# EAGLE design 22VPowerBoard (EAGLE 8.5.0)
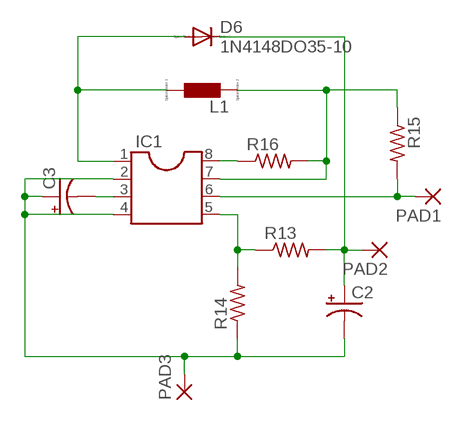
[diagram p0: schematic, sheet 1]

## Parts
C2  CPOL-USE2.5-7  [E2,5-7]
C3  CPOL-USE2.5-7  [E2,5-7]
D6  1N4148DO35-10  [DO35-10]
IC1  DIL8  [DIL08]
L1  L0207/10  [0207/10]
PAD1  3,81/1,4  [3,81/1,4]
PAD2  3,81/1,4  [3,81/1,4]
PAD3  3,81/1,4  [3,81/1,4]
R13  R-US_0207/7  [0207/7]
R14  R-US_0207/7  [0207/7]
R15  R-US_0207/7  [0207/7]
R16  R-US_0207/7  [0207/7]

## Nets
N$1: C2.- C3.+ IC1.2 IC1.4 PAD3.1(P) R14.1
N$5: D6.A IC1.1 L1.1
N$10: C3.- IC1.3
N$11: IC1.8 R16.1
N$12: IC1.7 L1.2 R15.1 R16.2
N$13: IC1.5 R13.1 R14.2
VDD: IC1.6 PAD1.1(P) R15.2
VG2: C2.+ D6.C PAD2.1(P) R13.2

## Library data of the parts
C2 C3 = rcl:CPOL-US: POLARIZED CAPACITOR, American symbol; SPICEPREFIX: C
D6 = diode:1N4148: DIODE high speed (Philips)
IC1 = ic-package:DIL8: Dual In Line / Socket
L1 = eagle-ltspice:L: INDUCTOR, European symbol; SPICEMODEL: NONE; SPICEPREFIX: L
PAD1-PAD3 = wirepad:3,81/1,4: THROUGH-HOLE PAD
R13-R16 = rcl:R-US_: RESISTOR, American symbol; SPICEPREFIX: R

## Board
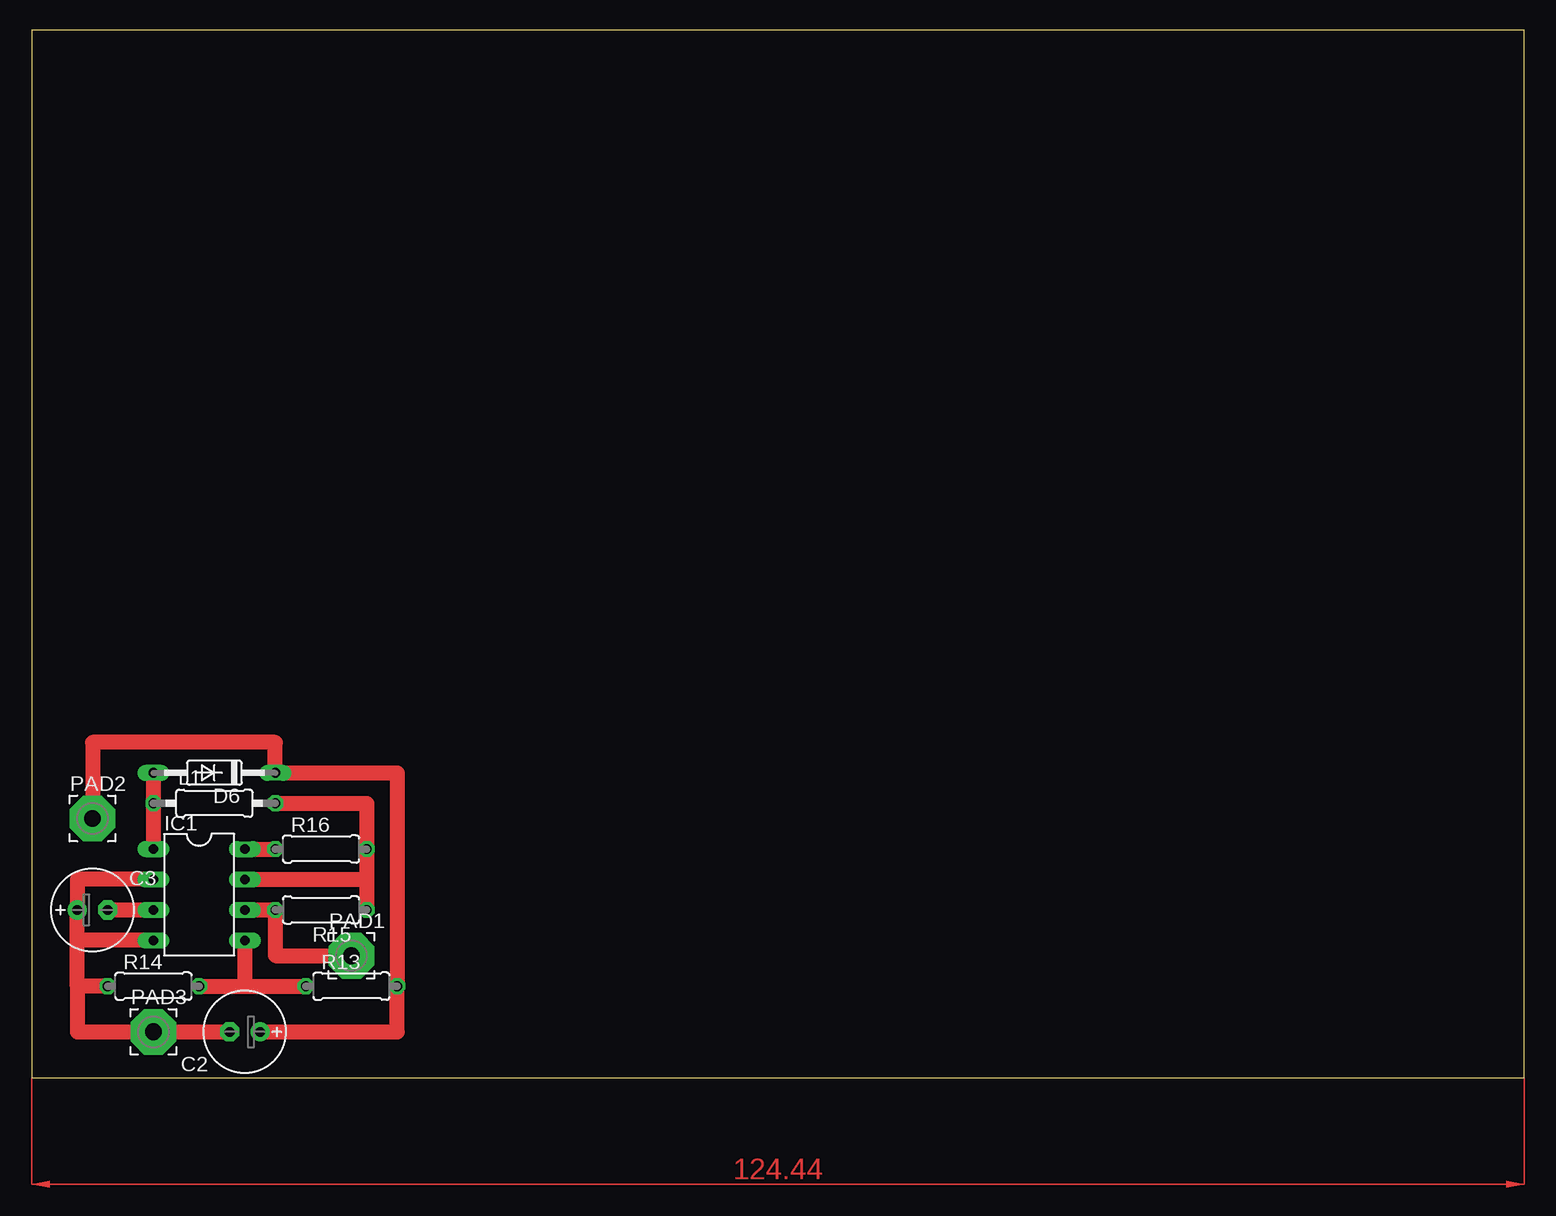
[diagram p1: board, top side]

Size 124.44 x 87.3 mm. Coordinates in mm from the lower left corner, seen from the top.
Outline: 0,0 124.44,0 124.44,87.3 0,87.3 0,0
Copper layers (1*16): Top 0.035mm / dielectric 1.5mm / Bottom 0.035mm
Design rules "default": minimum track width 6mil, minimum drill 0.35mm, track to track 6mil, track to pad 6mil, pad to pad 6mil, via to via 6mil, smd to smd 6mil, copper to edge 40mil, drill to drill 6mil, minimum pad ring 10mil, minimum via ring 8mil, stop-mask expansion 4mil, vias tented up to drill 0mil, thermal gap 10mil

### Footprints (pad centres in the part's own frame; a part is rotated, then mirrored left to right if it is on the bottom)
E2,5-7 = drill 0.813 pad 1.6: + -1.27,0 | drill 0.813 pad 1.6 octagon: - 1.27,0
DO35-10 = drill 0.813 long: A 5.08,0; C -5.08,0
DIL08 = drill 0.813 long: 1 -3.81,-3.81; 2 -1.27,-3.81; 3 1.27,-3.81; 4 3.81,-3.81; 5 3.81,3.81; 6 1.27,3.81; 7 -1.27,3.81; 8 -3.81,3.81
0207/10 = drill 0.813 octagon: 1 -5.08,0; 2 5.08,0
3,81/1,4 = drill 1.397 pad 3.81 octagon: 1 0,0
0207/7 = drill 0.813 octagon: 1 -3.81,0; 2 3.81,0

### Placement (x,y rotation side)
C2  17.78,3.81 180 top
C3  5.08,13.97 0 top
D6  15.24,25.4 180 top
IC1  13.97,15.24 270 top
L1  15.24,22.86 0 top
PAD1  26.67,10.16 0 top
PAD2  5.08,21.59 0 top
PAD3  10.16,3.81 0 top
R13  26.67,7.62 0 top
R14  10.16,7.62 0 top
R15  24.13,13.97 180 top
R16  24.13,19.05 0 top

### Tracks (layer width: path | path; a pad name or v marks a point on that pad's centre or on a via)
N$1
  Top 1.27: R14.1 3.81,7.62 | 3.81,7.62 3.81,11.43 | 3.81,11.43 C3.+ 3.81,16.51 IC1.2 | IC1.4 3.81,11.43 | 3.81,7.62 3.81,3.81 PAD3.1 C2.-
N$5
  Top 1.27: IC1.1 L1.1 D6.A
N$10
  Top 1.27: C3.- IC1.3
N$11
  Top 1.27: IC1.8 R16.1
N$12
  Top 1.27: 27.94,16.51 R16.2 27.94,22.86 L1.2 | 27.94,16.51 R15.1 | IC1.7 27.94,16.51
N$13
  Top 1.27: IC1.5 17.78,7.62 | 17.78,7.62 R13.1 | R14.2 17.78,7.62
VDD
  Top 1.27: IC1.6 R15.2 20.32,10.16 PAD1.1
VG2
  Top 1.27: C2.+ 30.48,3.81 R13.2 30.48,25.4 D6.C 20.32,27.94 5.08,27.94 PAD2.1
(copper drawn outside any net)
  shapes: Top area x1